# EAGLE design picstick_shield_v1 (EAGLE 7.2.0)
pickstick - open source hardware
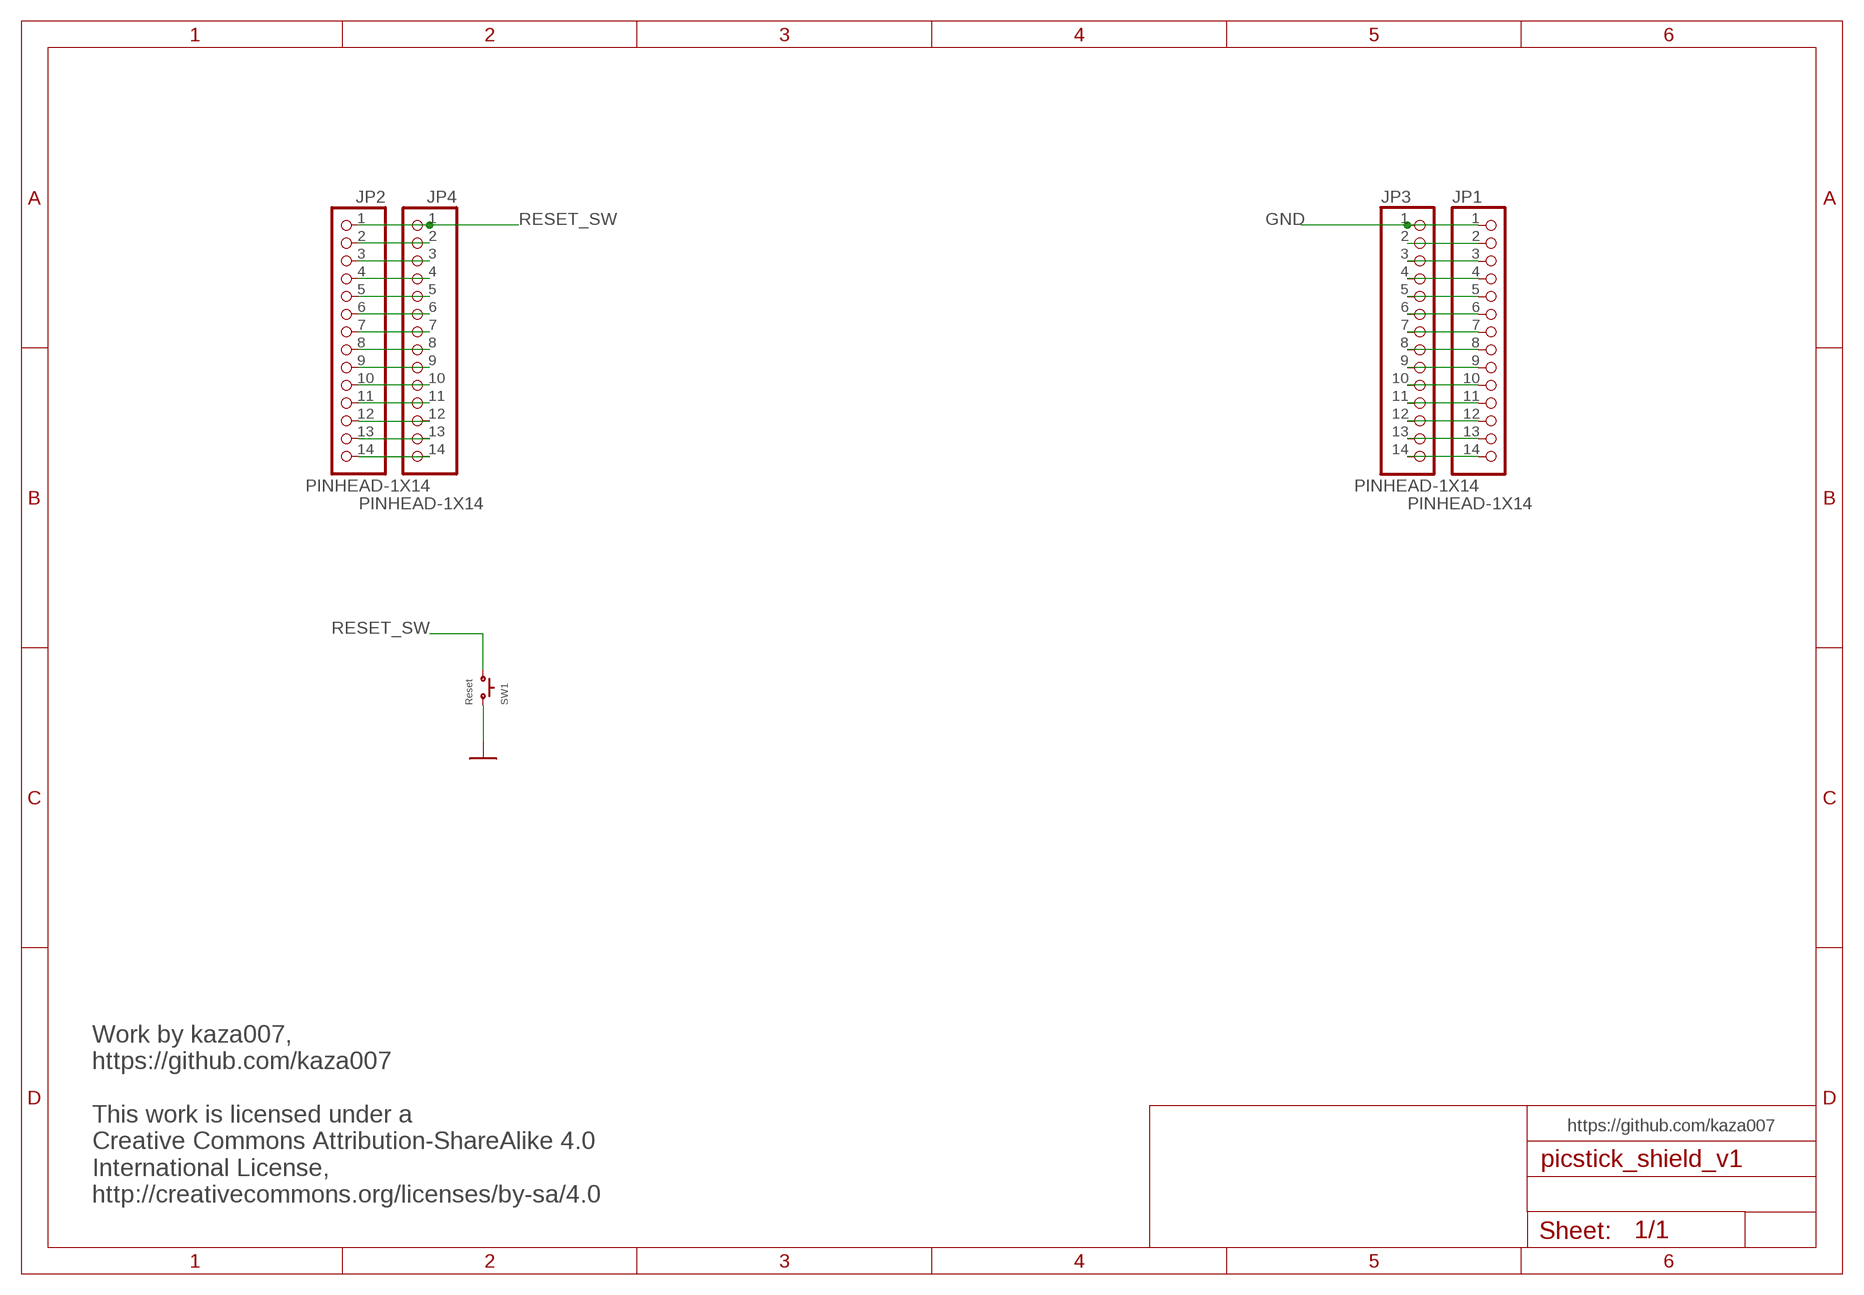
[diagram p0: schematic, sheet 1]

## Parts
JP1  PINHEAD-1X14  [PINHEAD-1X14]
JP2  PINHEAD-1X14  [PINHEAD-1X14]
JP3  PINHEAD-1X14  [PINHEAD-1X14]
JP4  PINHEAD-1X14  [PINHEAD-1X14]
SW1  Reset  SKHLAAA010  [SKHLAAA010]

## Nets
GND: JP1.1 JP3.1 SW1.1
N$1: JP1.2 JP3.2
N$87: JP2.7 JP4.7
N$88: JP2.8 JP4.8
N$89: JP2.9 JP4.9
N$90: JP2.10 JP4.10
N$91: JP2.11 JP4.11
N$92: JP2.12 JP4.12
N$93: JP2.13 JP4.13
N$94: JP2.14 JP4.14
N$95: JP1.3 JP3.3
N$96: JP1.4 JP3.4
N$97: JP1.5 JP3.5
N$98: JP1.6 JP3.6
N$99: JP1.7 JP3.7
N$100: JP1.8 JP3.8
N$101: JP1.9 JP3.9
N$102: JP1.10 JP3.10
N$103: JP1.11 JP3.11
N$104: JP1.12 JP3.12
N$105: JP1.13 JP3.13
N$106: JP1.14 JP3.14
RB2: JP2.6 JP4.6
RB3: JP2.5 JP4.5
RB4: JP2.4 JP4.4
RB5: JP2.3 JP4.3
RB6: JP2.2 JP4.2
RESET_SW: JP2.1 JP4.1 SW1.2

## Notes on the sheet
- https://github.com/kaza007
- Work by kaza007,
  https://github.com/kaza007
  
  This work is licensed under a 
  Creative Commons Attribution-ShareAlike 4.0
  International License,
  http://creativecommons.org/licenses/by-sa/4.0

## Library data of the parts
JP1-JP4 = BaseApp:PINHEAD-1X14
SW1 = alps:SKHLAAA010

## Board
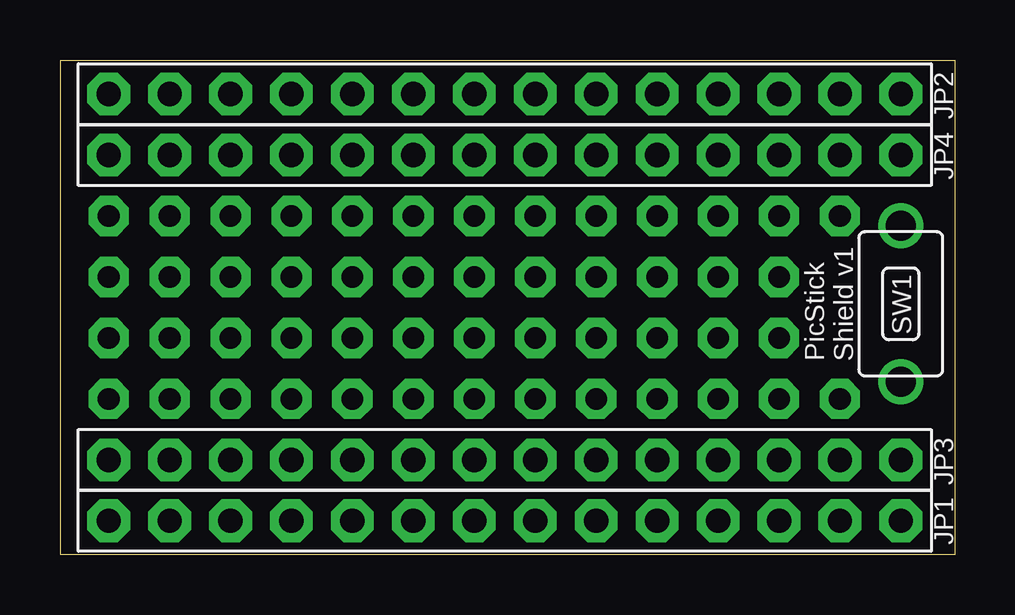
[diagram p1: board, top side]
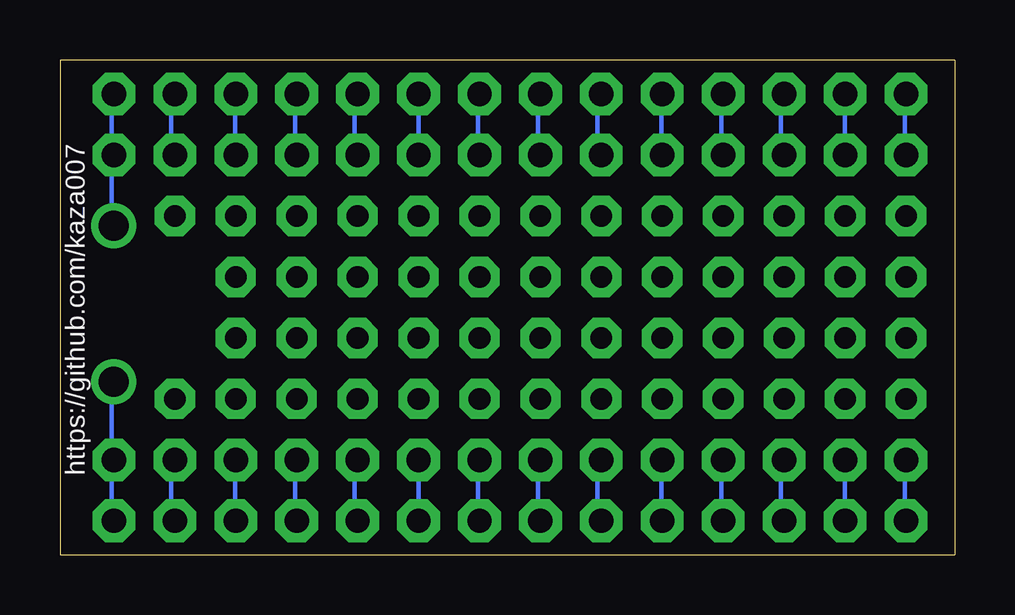
[diagram p2: board, bottom side, seen from below]

Size 37.3 x 20.62 mm. Coordinates in mm from the lower left corner, seen from the top.
Outline: 0,20.62 37.3,20.62 37.3,0 0,0 0,20.62
Copper layers (1*16): Top 0.035mm / dielectric 1.5mm / Bottom 0.035mm
Design rules "ShenZhen2U EagleRules": minimum track width 7mil, minimum drill 12mil, track to track 7mil, track to pad 7mil, pad to pad 7mil, via to via 7mil, smd to smd 0mil, copper to edge 20mil, drill to drill 10mil, minimum pad ring 10mil, minimum via ring 6mil, stop-mask expansion 2mil, vias tented up to drill 25mil, thermal gap 10mil

### Footprints (pad centres in the part's own frame; a part is rotated, then mirrored left to right if it is on the bottom)
PINHEAD-1X14 = drill 1.016 pad 1.778 octagon: 1 -16.51,0; 2 -13.97,0; 3 -11.43,0; 4 -8.89,0; 5 -6.35,0; 6 -3.81,0; 7 -1.27,0; 8 1.27,0; 9 3.81,0; 10 6.35,0; 11 8.89,0; 12 11.43,0; 13 13.97,0; 14 16.51,0
SKHLAAA010 = drill 1.25: 1 -3.25,0; 2 3.25,0

### Placement (x,y rotation side)
JP1  18.54,1.42 180 top
JP2  18.54,19.2 180 top
JP3  18.54,3.96 180 top
JP4  18.54,16.66 180 top
SW1  35.05,10.46 90 top

### Tracks (layer width: path | path; a pad name or v marks a point on that pad's centre or on a via)
GND
  Bottom 0.178: JP1.1 35.15,1.55 35.15,3.86 JP3.1 35.15,4.04 35.15,7.06 SW1.1
N$1
  Bottom 0.178: JP1.2 32.66,1.55 32.66,3.86 JP3.2
N$2  (via drill 0.9 pad 1.68)
  other vias: 2.03,14.12
N$4  (via drill 0.9 pad 1.68)
  other vias: 2.03,11.58
N$5  (via drill 0.9 pad 1.68)
  other vias: 2.03,9.04
N$6  (via drill 0.9 pad 1.68)
  other vias: 2.03,6.5
N$7  (via drill 0.9 pad 1.68)
  other vias: 4.57,14.12
N$8  (via drill 0.9 pad 1.68)
  other vias: 4.57,11.58
N$9  (via drill 0.9 pad 1.68)
  other vias: 4.57,9.04
N$10  (via drill 0.9 pad 1.68)
  other vias: 4.57,6.5
N$11  (via drill 0.9 pad 1.68)
  other vias: 7.11,6.5
N$12  (via drill 0.9 pad 1.68)
  other vias: 7.11,9.04
N$13  (via drill 0.9 pad 1.68)
  other vias: 7.11,11.58
N$14  (via drill 0.9 pad 1.68)
  other vias: 7.11,14.12
N$15  (via drill 0.9 pad 1.68)
  other vias: 9.65,14.12
N$16  (via drill 0.9 pad 1.68)
  other vias: 9.65,11.58
N$17  (via drill 0.9 pad 1.68)
  other vias: 9.65,9.04
N$18  (via drill 0.9 pad 1.68)
  other vias: 9.65,6.5
N$19  (via drill 0.9 pad 1.68)
  other vias: 12.19,6.5
N$20  (via drill 0.9 pad 1.68)
  other vias: 12.19,9.04
N$21  (via drill 0.9 pad 1.68)
  other vias: 12.19,11.58
N$22  (via drill 0.9 pad 1.68)
  other vias: 12.19,14.12
N$23  (via drill 0.9 pad 1.68)
  other vias: 14.73,14.12
N$24  (via drill 0.9 pad 1.68)
  other vias: 14.73,11.58
N$25  (via drill 0.9 pad 1.68)
  other vias: 14.73,9.04
N$26  (via drill 0.9 pad 1.68)
  other vias: 14.73,6.5
N$27  (via drill 0.9 pad 1.68)
  other vias: 17.27,6.5
N$28  (via drill 0.9 pad 1.68)
  other vias: 17.27,9.04
N$29  (via drill 0.9 pad 1.68)
  other vias: 17.27,11.58
N$30  (via drill 0.9 pad 1.68)
  other vias: 17.27,14.12
N$31  (via drill 0.9 pad 1.68)
  other vias: 19.81,14.12
N$32  (via drill 0.9 pad 1.68)
  other vias: 19.81,11.58
N$33  (via drill 0.9 pad 1.68)
  other vias: 19.81,9.04
N$34  (via drill 0.9 pad 1.68)
  other vias: 19.81,6.5
N$35  (via drill 0.9 pad 1.68)
  other vias: 22.35,6.5
N$36  (via drill 0.9 pad 1.68)
  other vias: 22.35,9.04
N$37  (via drill 0.9 pad 1.68)
  other vias: 22.35,11.58
N$38  (via drill 0.9 pad 1.68)
  other vias: 22.35,14.12
N$39  (via drill 0.9 pad 1.68)
  other vias: 24.89,14.12
N$40  (via drill 0.9 pad 1.68)
  other vias: 24.89,11.58
N$41  (via drill 0.9 pad 1.68)
  other vias: 24.89,9.04
N$42  (via drill 0.9 pad 1.68)
  other vias: 24.89,6.5
N$43  (via drill 0.9 pad 1.68)
  other vias: 27.43,6.5
N$44  (via drill 0.9 pad 1.68)
  other vias: 27.43,9.04
N$45  (via drill 0.9 pad 1.68)
  other vias: 27.43,11.58
N$46  (via drill 0.9 pad 1.68)
  other vias: 27.43,14.12
N$47  (via drill 0.9 pad 1.68)
  other vias: 29.97,14.12
N$48  (via drill 0.9 pad 1.68)
  other vias: 29.97,11.58
N$49  (via drill 0.9 pad 1.68)
  other vias: 29.97,9.04
N$50  (via drill 0.9 pad 1.68)
  other vias: 29.97,6.5
N$51  (via drill 0.9 pad 1.68)
  other vias: 32.51,6.5
N$54  (via drill 0.9 pad 1.68)
  other vias: 32.51,14.12
N$87
  Bottom 0.178: JP4.7 19.86,16.66 19.86,19.15 JP2.7
N$88
  Bottom 0.178: JP4.8 17.37,16.66 17.37,19.15 JP2.8
N$89
  Bottom 0.178: JP4.9 14.88,16.66 14.88,19.15 JP2.9
N$90
  Bottom 0.178: JP4.10 12.22,16.66 12.22,19.15 JP2.10
N$91
  Bottom 0.178: JP4.11 9.73,16.66 9.73,19.15 JP2.11
N$92
  Bottom 0.178: JP4.12 7.24,16.66 7.24,19.15 JP2.12
N$93
  Bottom 0.178: JP2.13 JP4.13
N$94
  Bottom 0.178: JP4.14 2.08,16.66 2.08,19.15 JP2.14
N$95
  Bottom 0.178: JP1.3 30,1.55 30,3.86 JP3.3
N$96
  Bottom 0.178: JP1.4 27.51,1.55 27.51,3.86 JP3.4
N$97
  Bottom 0.178: JP1.5 25.02,1.55 25.02,3.86 JP3.5
N$98
  Bottom 0.178: JP3.6 JP1.6
N$99
  Bottom 0.178: JP1.7 19.86,1.55 19.86,3.86 JP3.7
N$100
  Bottom 0.178: JP1.8 17.37,1.55 17.37,3.86 JP3.8
N$101
  Bottom 0.178: JP1.9 14.88,1.55 14.88,3.86 JP3.9
N$102
  Bottom 0.178: JP1.10 12.22,1.55 12.22,3.86 JP3.10
N$103
  Bottom 0.178: JP1.11 9.73,1.55 9.73,3.86 JP3.11
N$104
  Bottom 0.178: JP1.12 7.24,1.55 7.24,3.86 JP3.12
N$105
  Bottom 0.178: JP3.13 JP1.13
N$106
  Bottom 0.178: JP1.14 2.08,1.55 2.08,3.86 JP3.14
RB2
  Bottom 0.178: JP2.6 JP4.6
RB3
  Bottom 0.178: JP4.5 25.02,16.66 25.02,19.15 JP2.5
RB4
  Bottom 0.178: JP4.4 27.51,16.66 27.51,19.15 JP2.4
RB5
  Bottom 0.178: JP4.3 30,16.66 30,19.15 JP2.3
RB6
  Bottom 0.178: JP4.2 32.66,16.66 32.66,19.15 JP2.2
RESET_SW
  Bottom 0.178: 35.15,16.66 35.15,19.15 JP2.1 | 35.15,16.66 35.15,13.82 SW1.2 | 35.15,16.66 JP4.1

### Text on the board
tPlace: SW1 | PicStick / Shield v1
bPlace: https://github.com/kaza007